# Altium schematic sheet EDU_High-Speed-Design_Power.SchDoc: Power
size 279 x 215 mm; Date: not used; ApprovedBy: not used; CheckedBy: not used; Author: not used; DrawnBy: not used; Organization: not used; Address4: not used; SheetNumber: 2; SheetTotal: 26; Time: not used; ImagePath: not used; Application_BuildNumber: not used
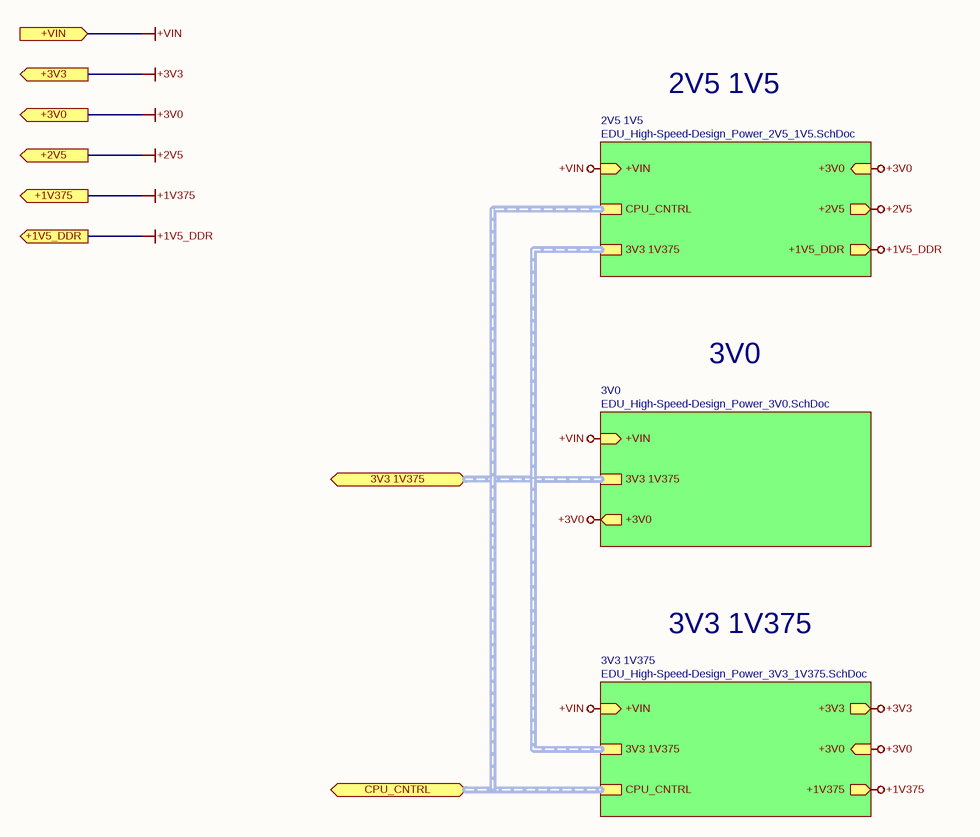
[diagram p0: EDU_High-Speed-Design_Power.SchDoc]

## Sub-sheets
2V5 1V5 = EDU_High-Speed-Design_Power_2V5_1V5.SchDoc: +VIN (in), +3V0 (in), +1V5_DDR (out), +2V5 (out), 3V3 1V375 (harness 3V3 1V375), CPU_CNTRL (harness CPU_CNTRL)
3V0 = EDU_High-Speed-Design_Power_3V0.SchDoc: +VIN (in), +3V0 (out), 3V3 1V375 (harness 3V3 1V375)
3V3 1V375 = EDU_High-Speed-Design_Power_3V3_1V375.SchDoc: +VIN (in), +3V3 (out), +1V375 (out), +3V0 (in), 3V3 1V375 (harness 3V3 1V375), CPU_CNTRL (harness CPU_CNTRL)

## Ports
3V3 1V375 (bidir, harness 3V3 1V375), +1V5_DDR (out), +1V375 (out), +2V5 (out), +3V0 (out), +3V3 (out), +VIN (in), CPU_CNTRL (bidir, harness CPU_CNTRL)

## Nets
+1V5_DDR: port +1V5_DDR, sheet 2V5 1V5/+1V5_DDR
+1V375: port +1V375, sheet 3V3 1V375/+1V375
+2V5: port +2V5, sheet 2V5 1V5/+2V5
+3V0: port +3V0, sheet 3V3 1V375/+3V0, sheet 3V0/+3V0, sheet 2V5 1V5/+3V0
+3V3: port +3V3, sheet 3V3 1V375/+3V3
+VIN: port +VIN, sheet 3V3 1V375/+VIN, sheet 3V0/+VIN, sheet 2V5 1V5/+VIN

## Buses and harness runs
harness port 3V3 1V375 = sheet 2V5 1V5/3V3 1V375 = sheet 3V0/3V3 1V375 = sheet 3V3 1V375/3V3 1V375
harness port CPU_CNTRL = sheet 2V5 1V5/CPU_CNTRL = sheet 3V3 1V375/CPU_CNTRL

## Notes on the sheet
- 2V5 1V5
- 3V0
- 3V3 1V375
- Title:
- Date:
- Size A
- Project:
- Time:
- Sheet
- Revision
- of
- Engineer:
- File: